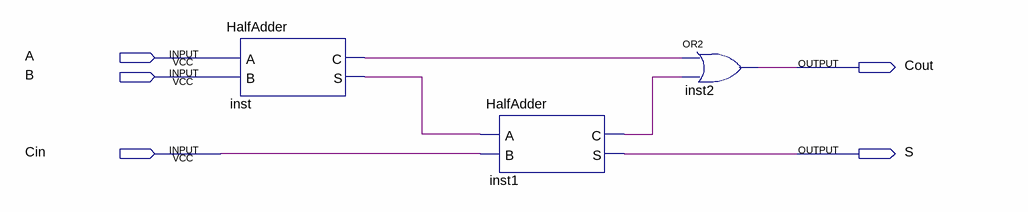
[diagram p0: schematic sheet]
// Quartus schematic FullAdder2.bdf as structural Verilog: 3 symbols, 5 pins
module FullAdder2 (
  input  A,
  input  B,
  input  Cin,
  output Cout,
  output S
);

  wire inst1_c, inst_c, inst_s;

  HalfAdder inst (.A(A), .B(B), .C(inst_c), .S(inst_s));
  HalfAdder inst1 (.A(inst_s), .B(Cin), .C(inst1_c), .S(S));
  or inst2 (Cout, inst_c, inst1_c);
endmodule
